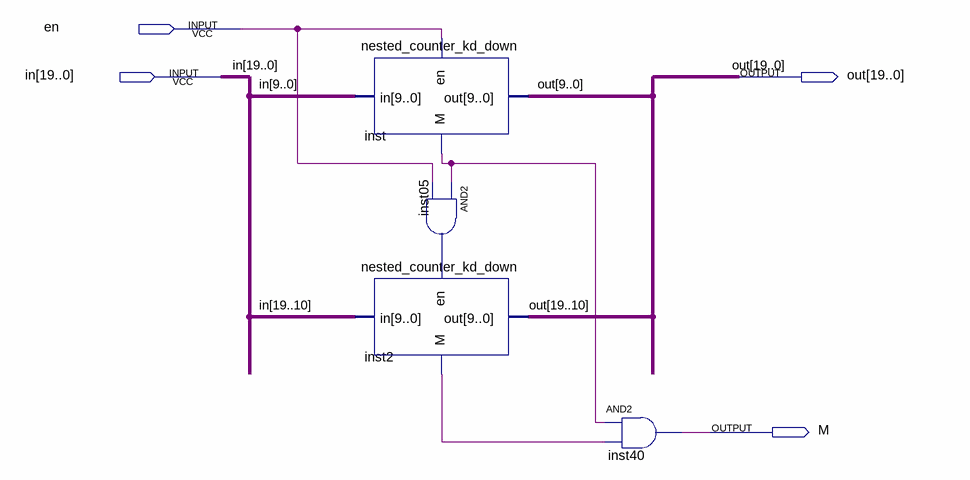
[diagram p0: schematic sheet]
// Quartus schematic nested_counter_md_down.bdf as structural Verilog: 4 symbols, 4 pins
module nested_counter_md_down (
  input  en,
  input  [19:0] in,
  output [19:0] out,
  output M
);

  wire inst2_m, inst05_out, inst_m;

  nested_counter_kd_down inst (.en(en), .in(in[9:0]), .out(out[9:0]), .M(inst_m));
  and inst05 (inst05_out, inst_m, en);
  nested_counter_kd_down inst2 (.en(inst05_out), .in(in[19:10]), .out(out[19:10]), .M(inst2_m));
  and inst40 (M, inst_m, inst2_m);
endmodule
